# EAGLE schematic (Eagle)PowerUnit-Bseries(ver2.0) (EAGLE 9.6.2)

## Sheet 1 of 3
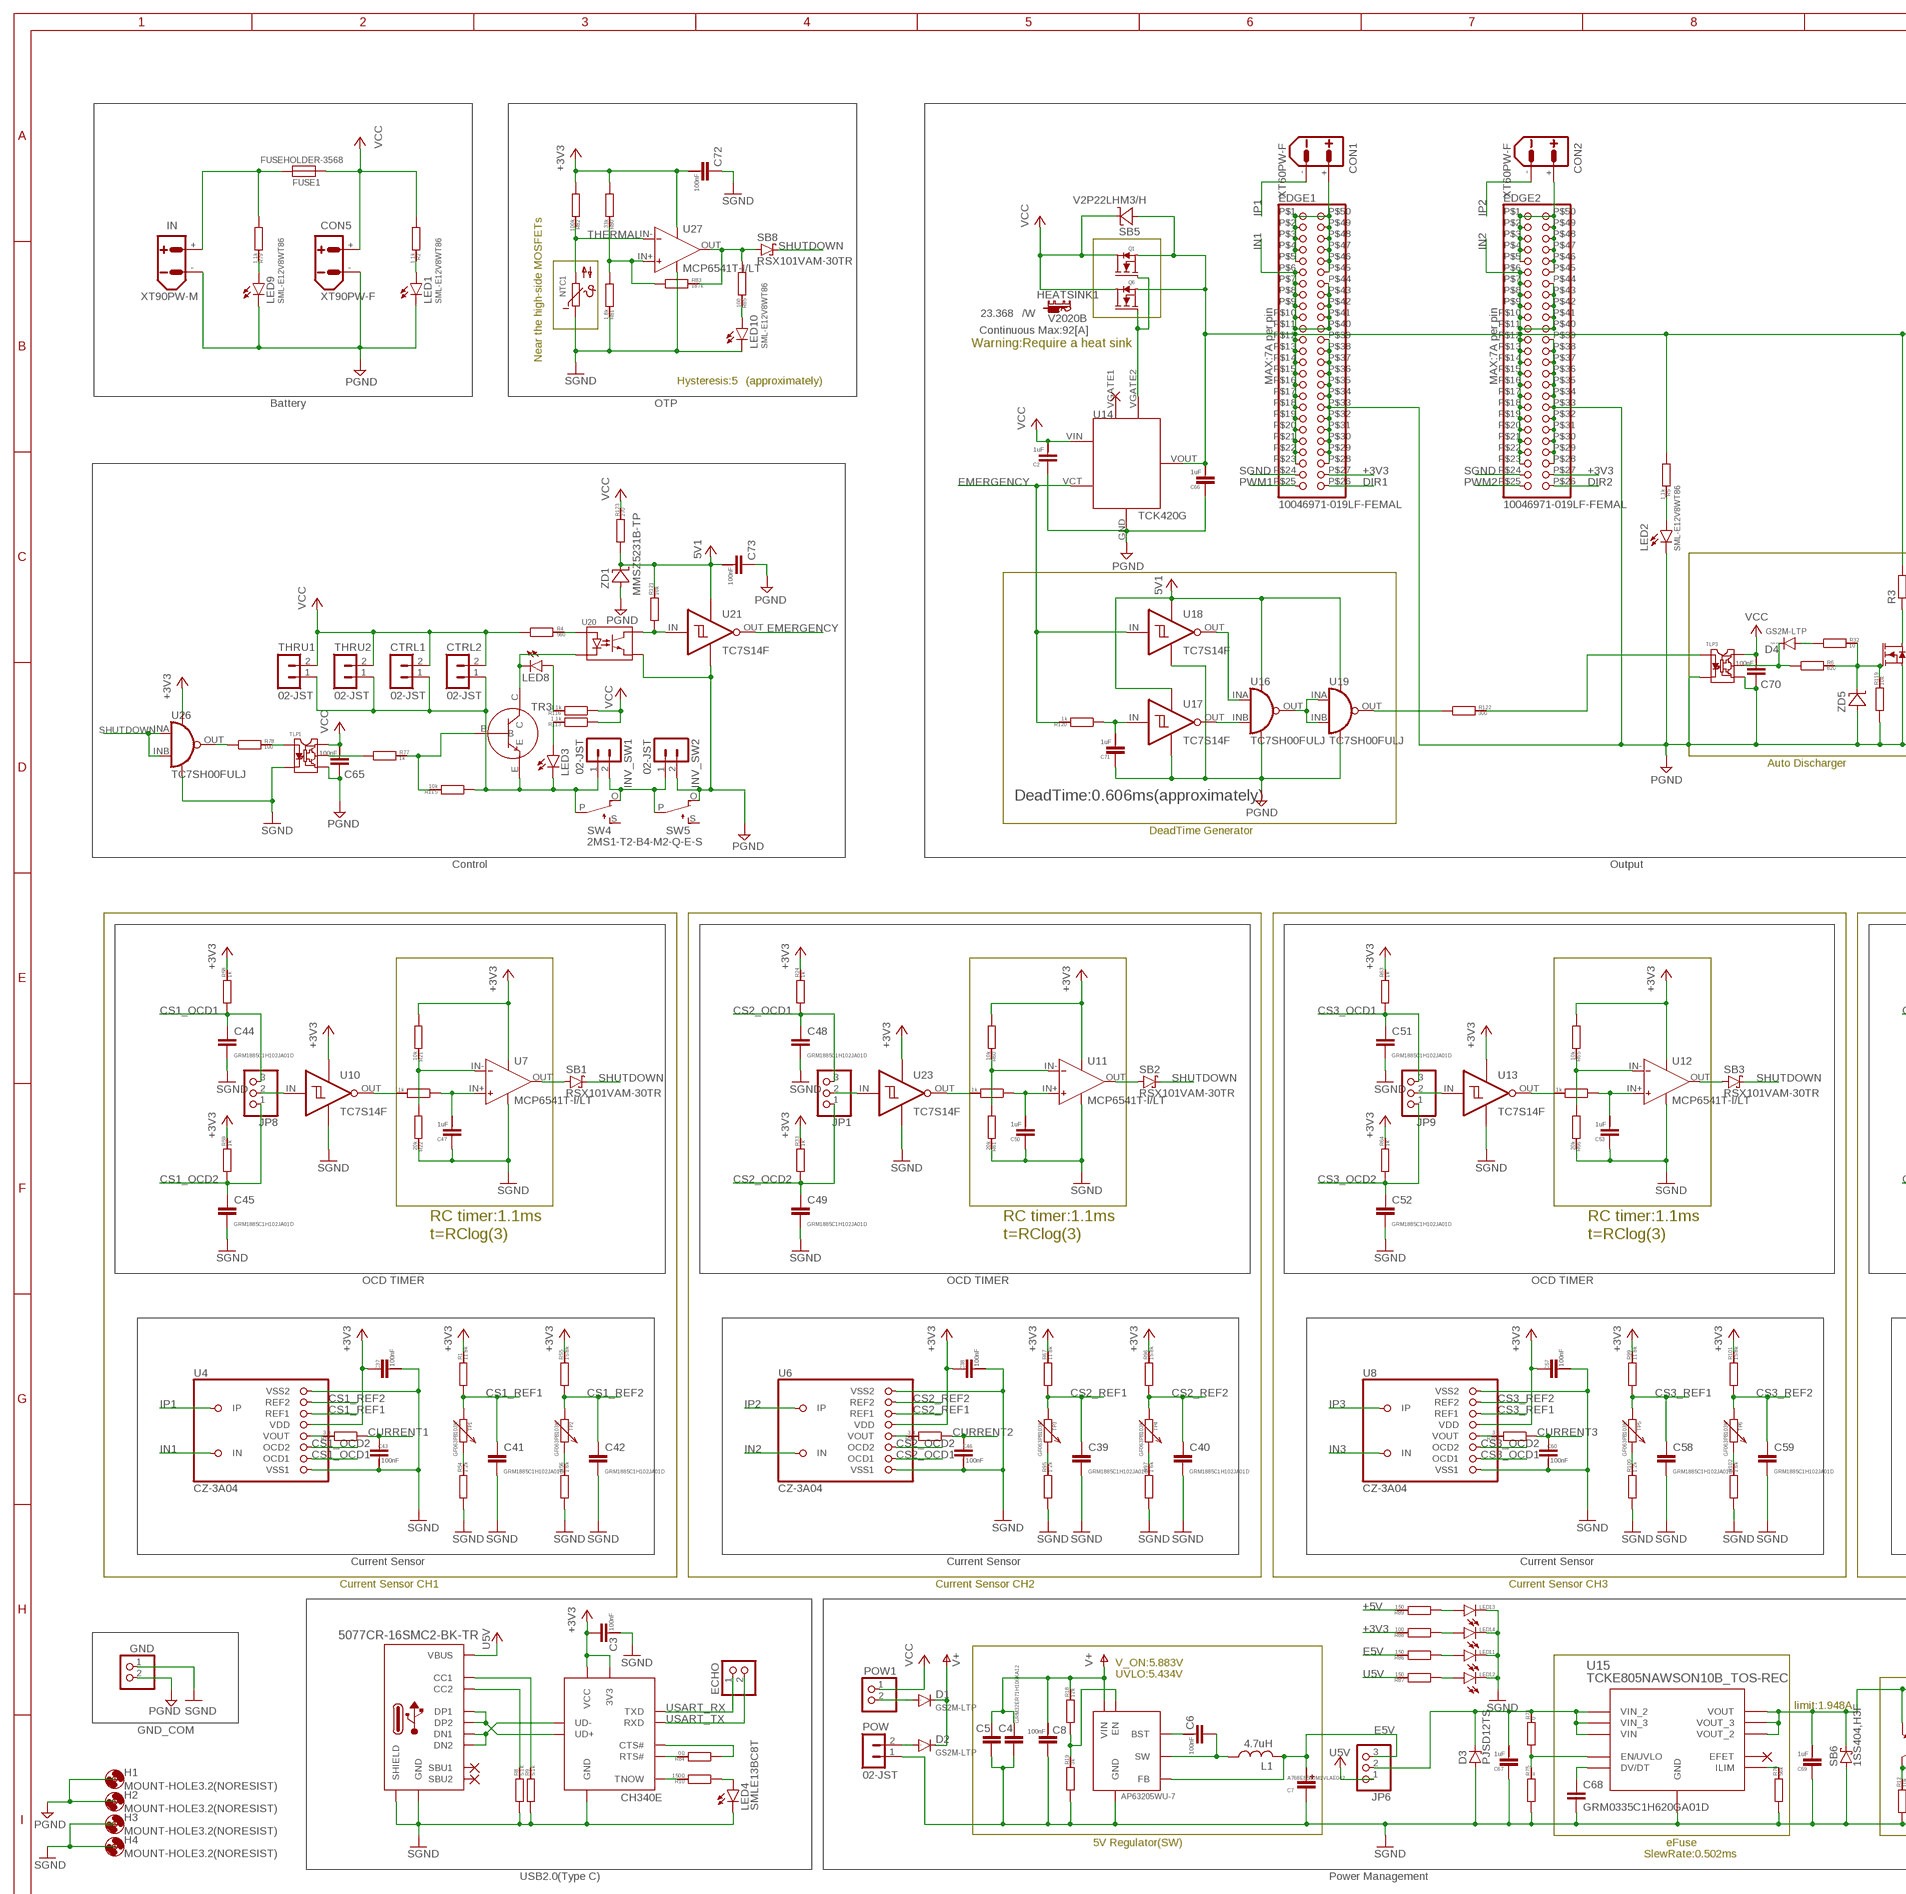
[diagram p0: schematic, sheet 1, part 1 of 2]
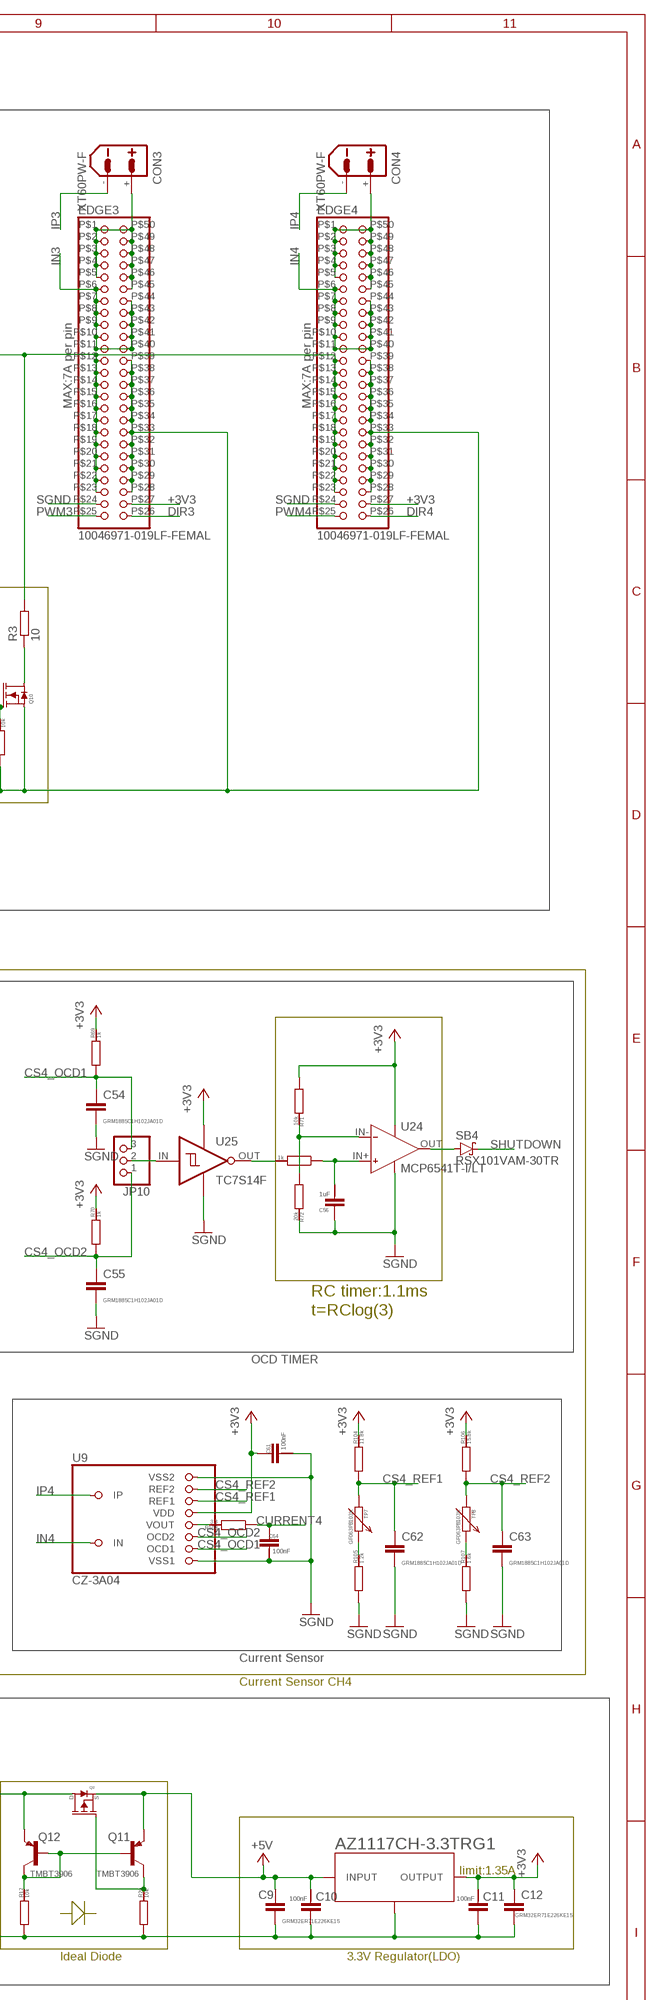
[diagram p1: schematic, sheet 1, part 2 of 2]

### Parts
C2  GRM21BC72A105KE01  [GRM21BC72A105KE01]
C3  GCM188L81H104KA57  [GCM188L81H104KA57]
C4  GRM32ER71H106KA12  [GRM32ER71H106KA12]
C5  GRM32ER71H106KA12  [GRM32ER71H106KA12]
C6  GCM188L81H104KA57  [GCM188L81H104KA57]
C7  A768EB566M1VLAE042  [A768EB566M1VLAE042]
C8  GCM188L81H104KA57  [GCM188L81H104KA57]
C9  GRM32ER71E226KE15  [3225M]
C10  GCM188L81H104KA57  [GCM188L81H104KA57]
C11  GCM188L81H104KA57  [GCM188L81H104KA57]
C12  GRM32ER71E226KE15  [3225M]
C37  GCM188L81H104KA57  [GCM188L81H104KA57]
C38  GCM188L81H104KA57  [GCM188L81H104KA57]
C39  GRM1885C1H102JA01D  [GRM18]
C40  GRM1885C1H102JA01D  [GRM18]
C41  GRM1885C1H102JA01D  [GRM18]
C42  GRM1885C1H102JA01D  [GRM18]
C43  GCM188L81H104KA57  [GCM188L81H104KA57]
C44  GRM1885C1H102JA01D  [GRM18]
C45  GRM1885C1H102JA01D  [GRM18]
C46  GCM188L81H104KA57  [GCM188L81H104KA57]
C47  GRM21BC72A105KE01  [GRM21BC72A105KE01]
C48  GRM1885C1H102JA01D  [GRM18]
C49  GRM1885C1H102JA01D  [GRM18]
C50  GRM21BC72A105KE01  [GRM21BC72A105KE01]
C51  GRM1885C1H102JA01D  [GRM18]
C52  GRM1885C1H102JA01D  [GRM18]
C53  GRM21BC72A105KE01  [GRM21BC72A105KE01]
C54  GRM1885C1H102JA01D  [GRM18]
C55  GRM1885C1H102JA01D  [GRM18]
C56  GRM21BC72A105KE01  [GRM21BC72A105KE01]
C57  GCM188L81H104KA57  [GCM188L81H104KA57]
C58  GRM1885C1H102JA01D  [GRM18]
C59  GRM1885C1H102JA01D  [GRM18]
C60  GCM188L81H104KA57  [GCM188L81H104KA57]
C61  GCM188L81H104KA57  [GCM188L81H104KA57]
C62  GRM1885C1H102JA01D  [GRM18]
C63  GRM1885C1H102JA01D  [GRM18]
C64  GCM188L81H104KA57  [GCM188L81H104KA57]
C65  GCM188L81H104KA57  [GCM188L81H104KA57]
C66  GRM21BC72A105KE01  [GRM21BC72A105KE01]
C67  GRM21BC72A105KE01  [GRM21BC72A105KE01]
C68  GRM0335C1H620GA01D  [GRM0335C1E240GA01D]
C69  GRM21BC72A105KE01  [GRM21BC72A105KE01]
C70  GCM188L81H104KA57  [GCM188L81H104KA57]
C71  GRM21BC72A105KE01  [GRM21BC72A105KE01]
C72  GCM188L81H104KA57  [GCM188L81H104KA57]
C73  GCM188L81H104KA57  [GCM188L81H104KA57]
CON1  XT60PW-F  [XT60PW-F]
CON2  XT60PW-F  [XT60PW-F]
CON3  XT60PW-F  [XT60PW-F]
CON4  XT60PW-F  [XT60PW-F]
CON5  XT90PW-F  [XT90PW-F]
CTRL1  02-JST  [B2B-XH]
CTRL2  02-JST  [B2B-XH]
D1  GS2M-LTP  [GS2M-LTP]
D2  GS2M-LTP  [GS2M-LTP]
D3  PJSD12TS  [SOD-523]
D4  GS2M-LTP  [GS2M-LTP]
ECHO  PINHD-1X2  [1X02]
EDGE1  10046971-019LF-FEMAL  [10046971-019LF]
EDGE2  10046971-019LF-FEMAL  [10046971-019LF]
EDGE3  10046971-019LF-FEMAL  [10046971-019LF]
EDGE4  10046971-019LF-FEMAL  [10046971-019LF]
FUSE1  FUSEHOLDER-3568  [FUSEHOLDER-3568]
GND  PINHD-1X2  [1X02]
H1  MOUNT-HOLE3.2(NORESIST)  [3,2]
H2  MOUNT-HOLE3.2(NORESIST)  [3,2]
H3  MOUNT-HOLE3.2(NORESIST)  [3,2]
H4  MOUNT-HOLE3.2(NORESIST)  [3,2]
HEATSINK1  V2020B  [V2020B]
IN  XT90PW-M  [XT90PW-M]
INV_SW1  02-JST  [B2B-XH]
INV_SW2  02-JST  [B2B-XH]
JP1  PINHD-1X3  [1X03]
JP6  PINHD-1X3  [1X03]
JP8  PINHD-1X3  [1X03]
JP9  PINHD-1X3  [1X03]
JP10  PINHD-1X3  [1X03]
L1  4.7uH  NRS5030T4R7MMGJ  [NRS5030T4R7MMGJ]
LED1  SML-E12V8WT86  [SML-E12V8WT86]
LED2  SML-E12V8WT86  [SML-E12V8WT86]
LED3  SML-E12V8WT86  [SML-E12V8WT86]
LED4  SMLE13BC8T  SML-E12V8WT86  [SML-E12V8WT86]
LED8  SML-E12V8WT86  [SML-E12V8WT86]
LED9  SML-E12V8WT86  [SML-E12V8WT86]
LED10  SML-E12V8WT86  [SML-E12V8WT86]
LED11  SML-E12V8WT86  [SML-E12V8WT86]
LED12  SML-E12V8WT86  [SML-E12V8WT86]
LED13  SML-E12V8WT86  [SML-E12V8WT86]
LED14  SML-E12V8WT86  [SML-E12V8WT86]
NTC1  NCU15WB473F60RC  [NCU15WB473F60RC]
POW  02-JST  [B2B-XH]
POW1  PINHD-1X2  [1X02]
Q1  SQJA16EP-T1_GE3  [SQJA16EP-T1_GE3]
Q2  SSM3J332R  [SOT-23F]
Q6  SQJA16EP-T1_GE3  [SQJA16EP-T1_GE3]
Q10  SQJA16EP-T1_GE3  [SQJA16EP-T1_GE3]
Q11  TMBT3906  [TMBT3906]
Q12  TMBT3906  [TMBT3906]
R1  11.8k  CR0603  [CR0603]
R2  1.1k  CR0603  [CR0603]
R3  10  RSMF2JT10R0  [0411V]
R4  560  CR0603  [CR0603]
R5  1.1k  CR0603  [CR0603]
R6  820  CR0603  [CR0603]
R8  5.1k  CR0603  [CR0603]
R9  5.1k  CR0603  [CR0603]
R10  150Ω  CR0603  [CR0603]
R12  10k  CR0603  [CR0603]
R18  12k  CR0603  [CR0603]
R19  3k  CR0603  [CR0603]
R20  10k  CR0603  [CR0603]
R21  10k  CR0603  [CR0603]
R22  20k  CR0603  [CR0603]
R23  1k  CR0603  [CR0603]
R24  1k  CR0603  [CR0603]
R32  10  CR0603  [CR0603]
R33  1k  CR0603  [CR0603]
R54  1.2k  CR0603  [CR0603]
R55  15.8k  CR0603  [CR0603]
R56  1.6k  CR0603  [CR0603]
R57  3.3  CR0603  [CR0603]
R58  1k  CR0603  [CR0603]
R59  1k  CR0603  [CR0603]
R60  10k  CR0603  [CR0603]
R61  20k  CR0603  [CR0603]
R62  1k  CR0603  [CR0603]
R63  1k  CR0603  [CR0603]
R64  1k  CR0603  [CR0603]
R65  10k  CR0603  [CR0603]
R66  20k  CR0603  [CR0603]
R67  11.8k  CR0603  [CR0603]
R68  1k  CR0603  [CR0603]
R69  1k  CR0603  [CR0603]
R70  1k  CR0603  [CR0603]
R71  10k  CR0603  [CR0603]
R72  20k  CR0603  [CR0603]
R73  1k  CR0603  [CR0603]
R74  0  CR0603  [CR0603]
R75  ∞  CR0603  [CR0603]
R76  56k  CR0603  [CR0603]
R77  1k  CR0603  [CR0603]
R78  100  CR0603  [CR0603]
R79  1.1k  CR0603  [CR0603]
R80  33k  CR0603  [CR0603]
R81  1.8k  CR0603  [CR0603]
R82  100k  CR0603  [CR0603]
R83  187k  CR0603  [CR0603]
R84  0Ω  CR0603  [CR0603]
R85  100  CR0603  [CR0603]
R86  150  CR0603  [CR0603]
R87  150  CR0603  [CR0603]
R88  100  CR0603  [CR0603]
R89  150  CR0603  [CR0603]
R95  1.2k  CR0603  [CR0603]
R96  15.8k  CR0603  [CR0603]
R97  1.6k  CR0603  [CR0603]
R98  3.3  CR0603  [CR0603]
R99  11.8k  CR0603  [CR0603]
R100  1.2k  CR0603  [CR0603]
R101  15.8k  CR0603  [CR0603]
R102  1.6k  CR0603  [CR0603]
R103  3.3  CR0603  [CR0603]
R104  11.8k  CR0603  [CR0603]
R105  1.2k  CR0603  [CR0603]
R106  15.8k  CR0603  [CR0603]
R107  1.6k  CR0603  [CR0603]
R108  3.3  CR0603  [CR0603]
R113  1.1k  CR0603  [CR0603]
R115  10k  CR0603  [CR0603]
R116  1.1k  CR0603  [CR0603]
R119  10k  CR0603  [CR0603]
R120  1k  CR0603  [CR0603]
R121  10k  CR0603  [CR0603]
R122  300  CR0603  [CR0603]
R123  270  CR0603  [CR0603]
SB1  RSX101VAM-30TR  [RSX101VAM-30TR]
SB2  RSX101VAM-30TR  [RSX101VAM-30TR]
SB3  RSX101VAM-30TR  [RSX101VAM-30TR]
SB4  RSX101VAM-30TR  [RSX101VAM-30TR]
SB5  V2P22LHM3/H  [V2P22LHM3/H]
SB6  1SS404,H3F  [1SS404,H3F]
SB8  RSX101VAM-30TR  [RSX101VAM-30TR]
SW4  2MS1-T2-B4-M2-Q-E-S  [2MS1-T2-B4-M2-Q-E-S]
SW5  2MS1-T2-B4-M2-Q-E-S  [2MS1-T2-B4-M2-Q-E-S]
THRU1  02-JST  [B2B-XH]
THRU2  02-JST  [B2B-XH]
TLP1  TLP152  [TLP152]
TLP3  TLP152  [TLP152]
TP1  GF063PB103K  [GF063PB104K]
TP2  GF063PB103K  [GF063PB104K]
TP3  GF063PB103K  [GF063PB104K]
TP4  GF063PB103K  [GF063PB104K]
TP5  GF063PB103K  [GF063PB104K]
TP6  GF063PB103K  [GF063PB104K]
TP7  GF063PB103K  [GF063PB104K]
TP8  GF063PB103K  [GF063PB104K]
TR3  2SC3325  [2SC3325]
U3  CH340E  [MSOP-10]
U4  CZ-3A04  [CZ3A07]
U5  AP63205WU-7  [AP63203WU-7]
U6  CZ-3A04  [CZ3A07]
U7  MCP6541T-I/LT  [SC-70-5]
U8  CZ-3A04  [CZ3A07]
U9  CZ-3A04  [CZ3A07]
U10  TC7S14F  [TC7S14F]
U11  MCP6541T-I/LT  [SC-70-5]
U12  MCP6541T-I/LT  [SC-70-5]
U13  TC7S14F  [TC7S14F]
U14  TCK420G  [TCK420G]
U15  TCKE805NAWSON10B_TOS-REC  [WSON10B_TOS-RIC]
U16  TC7SH00FULJ  [SSOP5-P-0.65A]
U17  TC7S14F  [TC7S14F]
U18  TC7S14F  [TC7S14F]
U19  TC7SH00FULJ  [SSOP5-P-0.65A]
U20  TLP293  [TLP293]
U21  TC7S14F  [TC7S14F]
U23  TC7S14F  [TC7S14F]
U24  MCP6541T-I/LT  [SC-70-5]
U25  TC7S14F  [TC7S14F]
U26  TC7SH00FULJ  [SSOP5-P-0.65A]
U27  MCP6541T-I/LT  [SC-70-5]
U$4  AZ1117CH-3.3TRG1  [AZ1117C]
USB1  5077CR-16SMC2-BK-TR  [5077CR-16SMC2-BK-TR]
ZD1  MMSZ5231B-TP  [MMSZ5231B-TP]
ZD5  MMBZ5248B-TP  [MMBZ5248B-TP]

### Nets
5V1: C73.P$1 R121.RIGHT R123.LEFT U16.VCC U17.VCC U18.VCC U19.VCC U21.VCC ZD1.CATHODE(C) ; supply symbol labelled VCC
+3V3: C3.P$2 C11.P$1 C12.L C37.P$2 C38.P$2 C57.P$2 C61.P$2 C72.P$1 EDGE1.P$27(P27) EDGE2.P$27(P27) EDGE3.P$27(P27) EDGE4.P$27(P27) R1.RIGHT R21.LEFT R24.RIGHT R33.RIGHT R55.RIGHT R58.RIGHT R59.RIGHT R60.LEFT R63.RIGHT R64.RIGHT R65.LEFT R67.RIGHT R69.RIGHT R70.RIGHT R71.LEFT R80.LEFT R82.LEFT R88.RIGHT R96.RIGHT R99.RIGHT R101.RIGHT R104.RIGHT R106.RIGHT U3.3V3 U3.VCC U4.VDD U6.VDD U7.VDD U8.VDD U9.VDD U10.VCC U11.VDD U12.VDD U13.VCC U23.VCC U24.VDD U25.VCC U26.VCC U27.VDD U$4.OUTPUT U$4.VOUT(OUTPUT) ; also sheet 2,3
+5V: C9.L C10.P$1 Q2.S(SOURCE) Q11.E R89.RIGHT U$4.INPUT ; also sheet 2,3
CS1_OCD1: C44.L JP8.3 R58.LEFT U4.OCD1
CS1_OCD2: C45.L JP8.1 R59.LEFT U4.OCD2
CS1_REF1: C41.L R1.LEFT TP1.CENTER(LEFT) TP1.LEFT U4.REF1
CS1_REF2: C42.L R55.LEFT TP2.CENTER(LEFT) TP2.LEFT U4.REF2
CS2_OCD1: C48.L JP1.3 R24.LEFT U6.OCD1
CS2_OCD2: C49.L JP1.1 R33.LEFT U6.OCD2
CS2_REF1: C39.L R67.LEFT TP3.CENTER(LEFT) TP3.LEFT U6.REF1
CS2_REF2: C40.L R96.LEFT TP4.CENTER(LEFT) TP4.LEFT U6.REF2
CS3_OCD1: C51.L JP9.3 R63.LEFT U8.OCD1
CS3_OCD2: C52.L JP9.1 R64.LEFT U8.OCD2
CS3_REF1: C58.L R99.LEFT TP5.CENTER(LEFT) TP5.LEFT U8.REF1
CS3_REF2: C59.L R101.LEFT TP6.CENTER(LEFT) TP6.LEFT U8.REF2
CS4_OCD1: C54.L JP10.3 R69.LEFT U9.OCD1
CS4_OCD2: C55.L JP10.1 R70.LEFT U9.OCD2
CS4_REF1: C62.L R104.LEFT TP7.CENTER(LEFT) TP7.LEFT U9.REF1
CS4_REF2: C63.L R106.LEFT TP8.CENTER(LEFT) TP8.LEFT U9.REF2
CURRENT1: C43.P$2 R57.LEFT ; also sheet 2
CURRENT2: C46.P$2 R98.LEFT ; also sheet 2
CURRENT3: C60.P$2 R103.LEFT ; also sheet 2
CURRENT4: C64.P$2 R108.LEFT ; also sheet 2
DIR1: EDGE1.P$26(P26) ; also sheet 2
DIR2: EDGE2.P$26(P26) ; also sheet 2
DIR3: EDGE3.P$26(P26) ; also sheet 2
DIR4: EDGE4.P$26(P26) ; also sheet 2
E5V: C7.ANODE JP6.3 L1.R R86.RIGHT U5.FB
EMERGENCY: R120.RIGHT U14.VCT U18.IN(I) U21.OUT(O)
IN1: EDGE1.P$6(P6) EDGE1.P$7(P7) EDGE1.P$8(P8) EDGE1.P$9(P9) EDGE1.P$10(P10) EDGE1.P$11(P11) EDGE1.P$40(P40) EDGE1.P$41(P41) EDGE1.P$42(P42) EDGE1.P$43(P43) EDGE1.P$44(P44) U4.IN
IN2: EDGE2.P$6(P6) EDGE2.P$7(P7) EDGE2.P$8(P8) EDGE2.P$9(P9) EDGE2.P$10(P10) EDGE2.P$11(P11) EDGE2.P$40(P40) EDGE2.P$41(P41) EDGE2.P$42(P42) EDGE2.P$43(P43) EDGE2.P$44(P44) U6.IN
IN3: EDGE3.P$6(P6) EDGE3.P$7(P7) EDGE3.P$8(P8) EDGE3.P$9(P9) EDGE3.P$10(P10) EDGE3.P$11(P11) EDGE3.P$40(P40) EDGE3.P$41(P41) EDGE3.P$42(P42) EDGE3.P$43(P43) EDGE3.P$44(P44) U8.IN
IN4: EDGE4.P$6(P6) EDGE4.P$7(P7) EDGE4.P$8(P8) EDGE4.P$9(P9) EDGE4.P$10(P10) EDGE4.P$11(P11) EDGE4.P$40(P40) EDGE4.P$41(P41) EDGE4.P$42(P42) EDGE4.P$43(P43) EDGE4.P$44(P44) U9.IN
IP1: CON1.- U4.IP
IP2: CON2.- U6.IP
IP3: CON3.- U8.IP
IP4: CON4.- U9.IP
N$1: R57.RIGHT U4.VOUT
N$2: R56.RIGHT TP2.RIGHT
N$3: LED2.A R5.RIGHT
N$4: CON1.+ EDGE1.P$1(P1) EDGE1.P$2(P2) EDGE1.P$3(P3) EDGE1.P$4(P4) EDGE1.P$5(P5) EDGE1.P$45(P45) EDGE1.P$46(P46) EDGE1.P$47(P47) EDGE1.P$48(P48) EDGE1.P$49(P49) EDGE1.P$50(P50)
N$5: CON2.+ EDGE2.P$1(P1) EDGE2.P$2(P2) EDGE2.P$3(P3) EDGE2.P$4(P4) EDGE2.P$5(P5) EDGE2.P$45(P45) EDGE2.P$46(P46) EDGE2.P$47(P47) EDGE2.P$48(P48) EDGE2.P$49(P49) EDGE2.P$50(P50)
N$6: CON3.+ EDGE3.P$1(P1) EDGE3.P$2(P2) EDGE3.P$3(P3) EDGE3.P$4(P4) EDGE3.P$5(P5) EDGE3.P$45(P45) EDGE3.P$46(P46) EDGE3.P$47(P47) EDGE3.P$48(P48) EDGE3.P$49(P49) EDGE3.P$50(P50)
N$7: LED8.A R116.RIGHT
N$8: R74.LEFT R75.RIGHT U15.EN/UVLO
N$9: JP8.2 U10.IN(I)
N$10: CON4.+ EDGE4.P$1(P1) EDGE4.P$2(P2) EDGE4.P$3(P3) EDGE4.P$4(P4) EDGE4.P$5(P5) EDGE4.P$45(P45) EDGE4.P$46(P46) EDGE4.P$47(P47) EDGE4.P$48(P48) EDGE4.P$49(P49) EDGE4.P$50(P50)
N$11: Q10.D R3.1
N$12: R77.LEFT TLP1.VO(VOUT)
N$13: R54.RIGHT TP1.RIGHT
N$14: R77.RIGHT R115.RIGHT TR3.B
N$16: LED8.K(C) TR3.C U20.CATHODE
N$17: LED1.A R2.RIGHT
N$18: R60.RIGHT R61.LEFT U11.IN-
N$19: INV_SW1.2 INV_SW2.1 SW4.O SW5.P
N$20: C67.P$1 D3.C JP6.2 R74.RIGHT U15.VIN1(VIN) U15.VIN2(VIN_2) U15.VIN3(VIN_3)
N$21: CTRL1.1 CTRL2.1 INV_SW1.1 LED3.K(C) R115.LEFT SW4.P THRU1.1 THRU2.1 TR3.E
N$22: U16.INB(I1) U17.OUT(O)
N$24: LED3.A R113.RIGHT
N$25: FUSE1.R1(R) FUSE1.R2(R) IN.+ R79.LEFT
N$26: Q1.G Q6.G U14.VGATE2
N$29: R8.RIGHT USB1.CC2
N$30: R9.RIGHT USB1.CC1
N$31: U3.UD+ USB1.DP1 USB1.DP2
N$32: U3.UD- USB1.DN1 USB1.DN2
N$33: R10.RIGHT U3.TNOW
N$34: LED4.A R10.LEFT
N$35: D1.A POW1.2
N$36: R18.LEFT R19.RIGHT U5.EN
N$37: D2.A POW.2
N$40: C6.P$2 L1.L U5.SW
N$41: C6.P$1 U5.BST
N$43: R21.RIGHT R22.LEFT U7.IN-
N$47: Q11.B Q12.B Q12.C R12.RIGHT
N$55: LED12.A R87.LEFT
N$75: C69.P$1 Q2.D(DRAIN) Q12.E SB6.C U15.VOUT1(VOUT) U15.VOUT2(VOUT_2) U15.VOUT3(VOUT_3)
N$76: C50.P$1 R62.LEFT U11.IN+
N$77: SB2.A U11.OUT
N$78: C47.P$1 R23.LEFT U7.IN+
N$79: R95.RIGHT TP3.RIGHT
N$80: R97.RIGHT TP4.RIGHT
N$81: R98.RIGHT U6.VOUT
N$82: R100.RIGHT TP5.RIGHT
N$83: JP1.2 U23.IN(I)
N$84: R65.RIGHT R66.LEFT U12.IN-
N$85: C53.P$1 R68.LEFT U12.IN+
N$86: SB3.A U12.OUT
N$87: JP9.2 U13.IN(I)
N$88: R68.RIGHT U13.OUT(O)
N$89: R71.RIGHT R72.LEFT U24.IN-
N$90: C56.P$1 R73.LEFT U24.IN+
N$91: SB4.A U24.OUT
N$92: R78.LEFT U26.OUT(O)
N$93: C71.P$1 R120.LEFT U17.IN(I)
N$94: R4.RIGHT U20.ANODE
N$95: D4.C R6.LEFT TLP3.VO(VOUT)
N$96: Q10.G R6.RIGHT R32.RIGHT R119.RIGHT ZD5.CATHODE(C)
N$97: SB1.A U7.OUT
N$98: R102.RIGHT TP6.RIGHT
N$99: R103.RIGHT U8.VOUT
N$100: R105.RIGHT TP7.RIGHT
N$101: R107.RIGHT TP8.RIGHT
N$102: R108.RIGHT U9.VOUT
N$103: Q2.G(GATE) Q11.C R20.RIGHT
N$105: R23.RIGHT U10.OUT(O)
N$106: R122.LEFT U19.OUT(O)
N$107: U16.INA(I0) U18.OUT(O)
N$108: U16.OUT(O) U19.INA(I0) U19.INB(I1)
N$109: R121.LEFT U20.COLLECTOR U21.IN(I)
N$110: R122.RIGHT TLP3.ANODE
N$111: C66.P$1 EDGE1.P$12(P12) EDGE1.P$13(P13) EDGE1.P$14(P14) EDGE1.P$15(P15) EDGE1.P$16(P16) EDGE1.P$17(P17) EDGE1.P$18(P18) EDGE1.P$19(P19) EDGE1.P$20(P20) EDGE1.P$21(P21) EDGE1.P$22(P22) EDGE1.P$23(P23) EDGE2.P$12(P12) EDGE2.P$13(P13) EDGE2.P$14(P14) EDGE2.P$15(P15) EDGE2.P$16(P16) EDGE2.P$17(P17) EDGE2.P$18(P18) EDGE2.P$19(P19) EDGE2.P$20(P20) EDGE2.P$21(P21) EDGE2.P$22(P22) EDGE2.P$23(P23) EDGE3.P$12(P12) EDGE3.P$13(P13) EDGE3.P$14(P14) EDGE3.P$15(P15) EDGE3.P$16(P16) EDGE3.P$17(P17) EDGE3.P$18(P18) EDGE3.P$19(P19) EDGE3.P$20(P20) EDGE3.P$21(P21) EDGE3.P$22(P22) EDGE3.P$23(P23) EDGE4.P$12(P12) EDGE4.P$13(P13) EDGE4.P$14(P14) EDGE4.P$15(P15) EDGE4.P$16(P16) EDGE4.P$17(P17) EDGE4.P$18(P18) EDGE4.P$19(P19) EDGE4.P$20(P20) EDGE4.P$21(P21) EDGE4.P$22(P22) EDGE4.P$23(P23) Q1.S1(S) Q1.S2(S) Q1.S3(S) Q6.S1(S) Q6.S2(S) Q6.S3(S) R3.2 R5.LEFT SB5.A U14.VOUT
N$112: D4.A R32.LEFT
N$113: R62.RIGHT U23.OUT(O)
N$114: JP10.2 U25.IN(I)
N$115: R73.RIGHT U25.OUT(O)
N$116: R76.RIGHT U15.ILIM
N$117: C68.1 U15.DVDT(DV/DT)
N$118: R78.RIGHT TLP1.ANODE
N$120: LED9.A R79.RIGHT
N$121: R84.RIGHT U3.RTS#
N$122: R80.RIGHT R81.LEFT R83.LEFT U27.IN+
N$123: R84.LEFT U3.CTS#
N$124: LED10.A R85.RIGHT
N$125: LED11.A R86.LEFT
N$126: R83.RIGHT R85.LEFT SB8.A U27.OUT
N$129: LED13.A R89.LEFT
N$130: LED14.A R88.LEFT
PGND: C2.P$2 C65.P$2 C66.P$2 C70.P$2 C71.P$2 C73.P$2 CON5.- EDGE1.P$28(P28) EDGE1.P$29(P29) EDGE1.P$30(P30) EDGE1.P$31(P31) EDGE1.P$32(P32) EDGE1.P$33(P33) EDGE1.P$34(P34) EDGE1.P$35(P35) EDGE1.P$36(P36) EDGE1.P$37(P37) EDGE1.P$38(P38) EDGE1.P$39(P39) EDGE2.P$28(P28) EDGE2.P$29(P29) EDGE2.P$30(P30) EDGE2.P$31(P31) EDGE2.P$32(P32) EDGE2.P$33(P33) EDGE2.P$34(P34) EDGE2.P$35(P35) EDGE2.P$36(P36) EDGE2.P$37(P37) EDGE2.P$38(P38) EDGE2.P$39(P39) EDGE3.P$28(P28) EDGE3.P$29(P29) EDGE3.P$30(P30) EDGE3.P$31(P31) EDGE3.P$32(P32) EDGE3.P$33(P33) EDGE3.P$34(P34) EDGE3.P$35(P35) EDGE3.P$36(P36) EDGE3.P$37(P37) EDGE3.P$38(P38) EDGE3.P$39(P39) EDGE4.P$28(P28) EDGE4.P$29(P29) EDGE4.P$30(P30) EDGE4.P$31(P31) EDGE4.P$32(P32) EDGE4.P$33(P33) EDGE4.P$34(P34) EDGE4.P$35(P35) EDGE4.P$36(P36) EDGE4.P$37(P37) EDGE4.P$38(P38) EDGE4.P$39(P39) GND.2 H1.P$1 H2.P$1 IN.- INV_SW2.2 LED1.K(C) LED2.K(C) LED9.K(C) Q10.S1(S) Q10.S2(S) Q10.S3(S) R119.LEFT SW5.O TLP1.GND TLP3.CATHODE TLP3.GND U14.GND U16.GND U17.GND U18.GND U19.GND U20.EMITTER U21.GND ZD1.ANODE(A) ZD5.ANODE(A) ; supply symbol labelled GND
PWM1: EDGE1.P$25(P25) ; also sheet 2
PWM2: EDGE2.P$25(P25) ; also sheet 2
PWM3: EDGE3.P$25(P25) ; also sheet 2
PWM4: EDGE4.P$25(P25) ; also sheet 2
SGND: C3.P$1 C4.R C5.R C7.CATHODE C8.P$2 C9.R C10.P$2 C11.P$2 C12.R C37.P$1 C38.P$1 C39.R C40.R C41.R C42.R C43.P$1 C44.R C45.R C46.P$1 C47.P$2 C48.R C49.R C50.P$2 C51.R C52.R C53.P$2 C54.R C55.R C56.P$2 C57.P$1 C58.R C59.R C60.P$1 C61.P$1 C62.R C63.R C64.P$1 C67.P$2 C68.2 C69.P$2 C72.P$2 D3.A EDGE1.P$24(P24) EDGE2.P$24(P24) EDGE3.P$24(P24) EDGE4.P$24(P24) GND.1 H3.P$1 H4.P$1 LED4.K(C) LED10.K(C) LED11.K(C) LED12.K(C) LED13.K(C) LED14.K(C) NTC1.L POW.1 R8.LEFT R9.LEFT R12.LEFT R19.LEFT R20.LEFT R22.RIGHT R54.LEFT R56.LEFT R61.RIGHT R66.RIGHT R72.RIGHT R75.LEFT R76.LEFT R81.RIGHT R95.LEFT R97.LEFT R100.LEFT R102.LEFT R105.LEFT R107.LEFT SB6.A TLP1.CATHODE U3.GND U4.VSS1 U4.VSS2 U5.GND U6.VSS1 U6.VSS2 U7.VSS U8.VSS1 U8.VSS2 U9.VSS1 U9.VSS2 U10.GND U11.VSS U12.VSS U13.GND U15.GND1(GND) U15.GND2(GND) U15.GND3(GND) U15.GND4(GND) U15.GND5(GND) U23.GND U24.VSS U25.GND U26.GND U27.VSS U$4.GND USB1.GND1(GND) USB1.GND2(GND) USB1.SHIELD1(SHIELD) USB1.SHIELD2(SHIELD) USB1.SHIELD3(SHIELD) USB1.SHIELD4(SHIELD) ; supply symbol labelled GND ; also sheet 2,3
SHUTDOWN: SB1.C SB2.C SB3.C SB4.C SB8.C U26.INA(I0) U26.INB(I1) ; also sheet 2
THERMAL: NTC1.R R82.RIGHT U27.IN- ; also sheet 2
U5V: JP6.1 R87.RIGHT USB1.VBUS1(VBUS) USB1.VBUS2(VBUS) ; supply symbol labelled +5V
USART_RX: ECHO.1 U3.TXD ; also sheet 2
USART_TX: ECHO.2 U3.RXD ; also sheet 2
V+: C4.L C5.L C8.P$1 D1.C D2.C R18.RIGHT U5.VIN
VCC: C2.P$1 C65.P$1 C70.P$1 CON5.+ CTRL1.2 CTRL2.2 FUSE1.L1(L) FUSE1.L2(L) POW1.1 Q1.D Q6.D R2.LEFT R4.LEFT R113.LEFT R116.LEFT R123.RIGHT SB5.C THRU1.2 THRU2.2 TLP1.VCC TLP3.VCC U14.VIN
Unconnected: SW4.S SW5.S U14.VGATE1 U15.EFET USB1.SBU1 USB1.SBU2

### Notes on the sheet
- 23.368℃/W
- Continuous Max:92[A]
- Warning:Require a heat sink
- Near the high-side MOSFETs
- Hysteresis:5℃(approximately)
- Battery | OTP
- Auto Discharger
- DeadTime:0.606ms(approximately)
- DeadTime Generator
- Control | Output
- RC timer:1.1ms | RC timer:1.1ms | RC timer:1.1ms | RC timer:1.1ms
- t=RClog(3) | t=RClog(3) | t=RClog(3) | t=RClog(3)
- OCD TIMER | OCD TIMER | OCD TIMER | OCD TIMER
- Current Sensor | Current Sensor | Current Sensor | Current Sensor
- Current Sensor CH1 | Current Sensor CH2 | Current Sensor CH3 | Current Sensor CH4
- V_ON:5.883V
- UVLO:5.434V
- limit:1.948A
- GND_COM
- limit:1.35A
- 5V Regulator(SW) | eFuse | Ideal Diode | 3.3V Regulator(LDO)
- SlewRate:0.502ms
- USB2.0(Type C) | Power Management

## Sheet 2 of 3
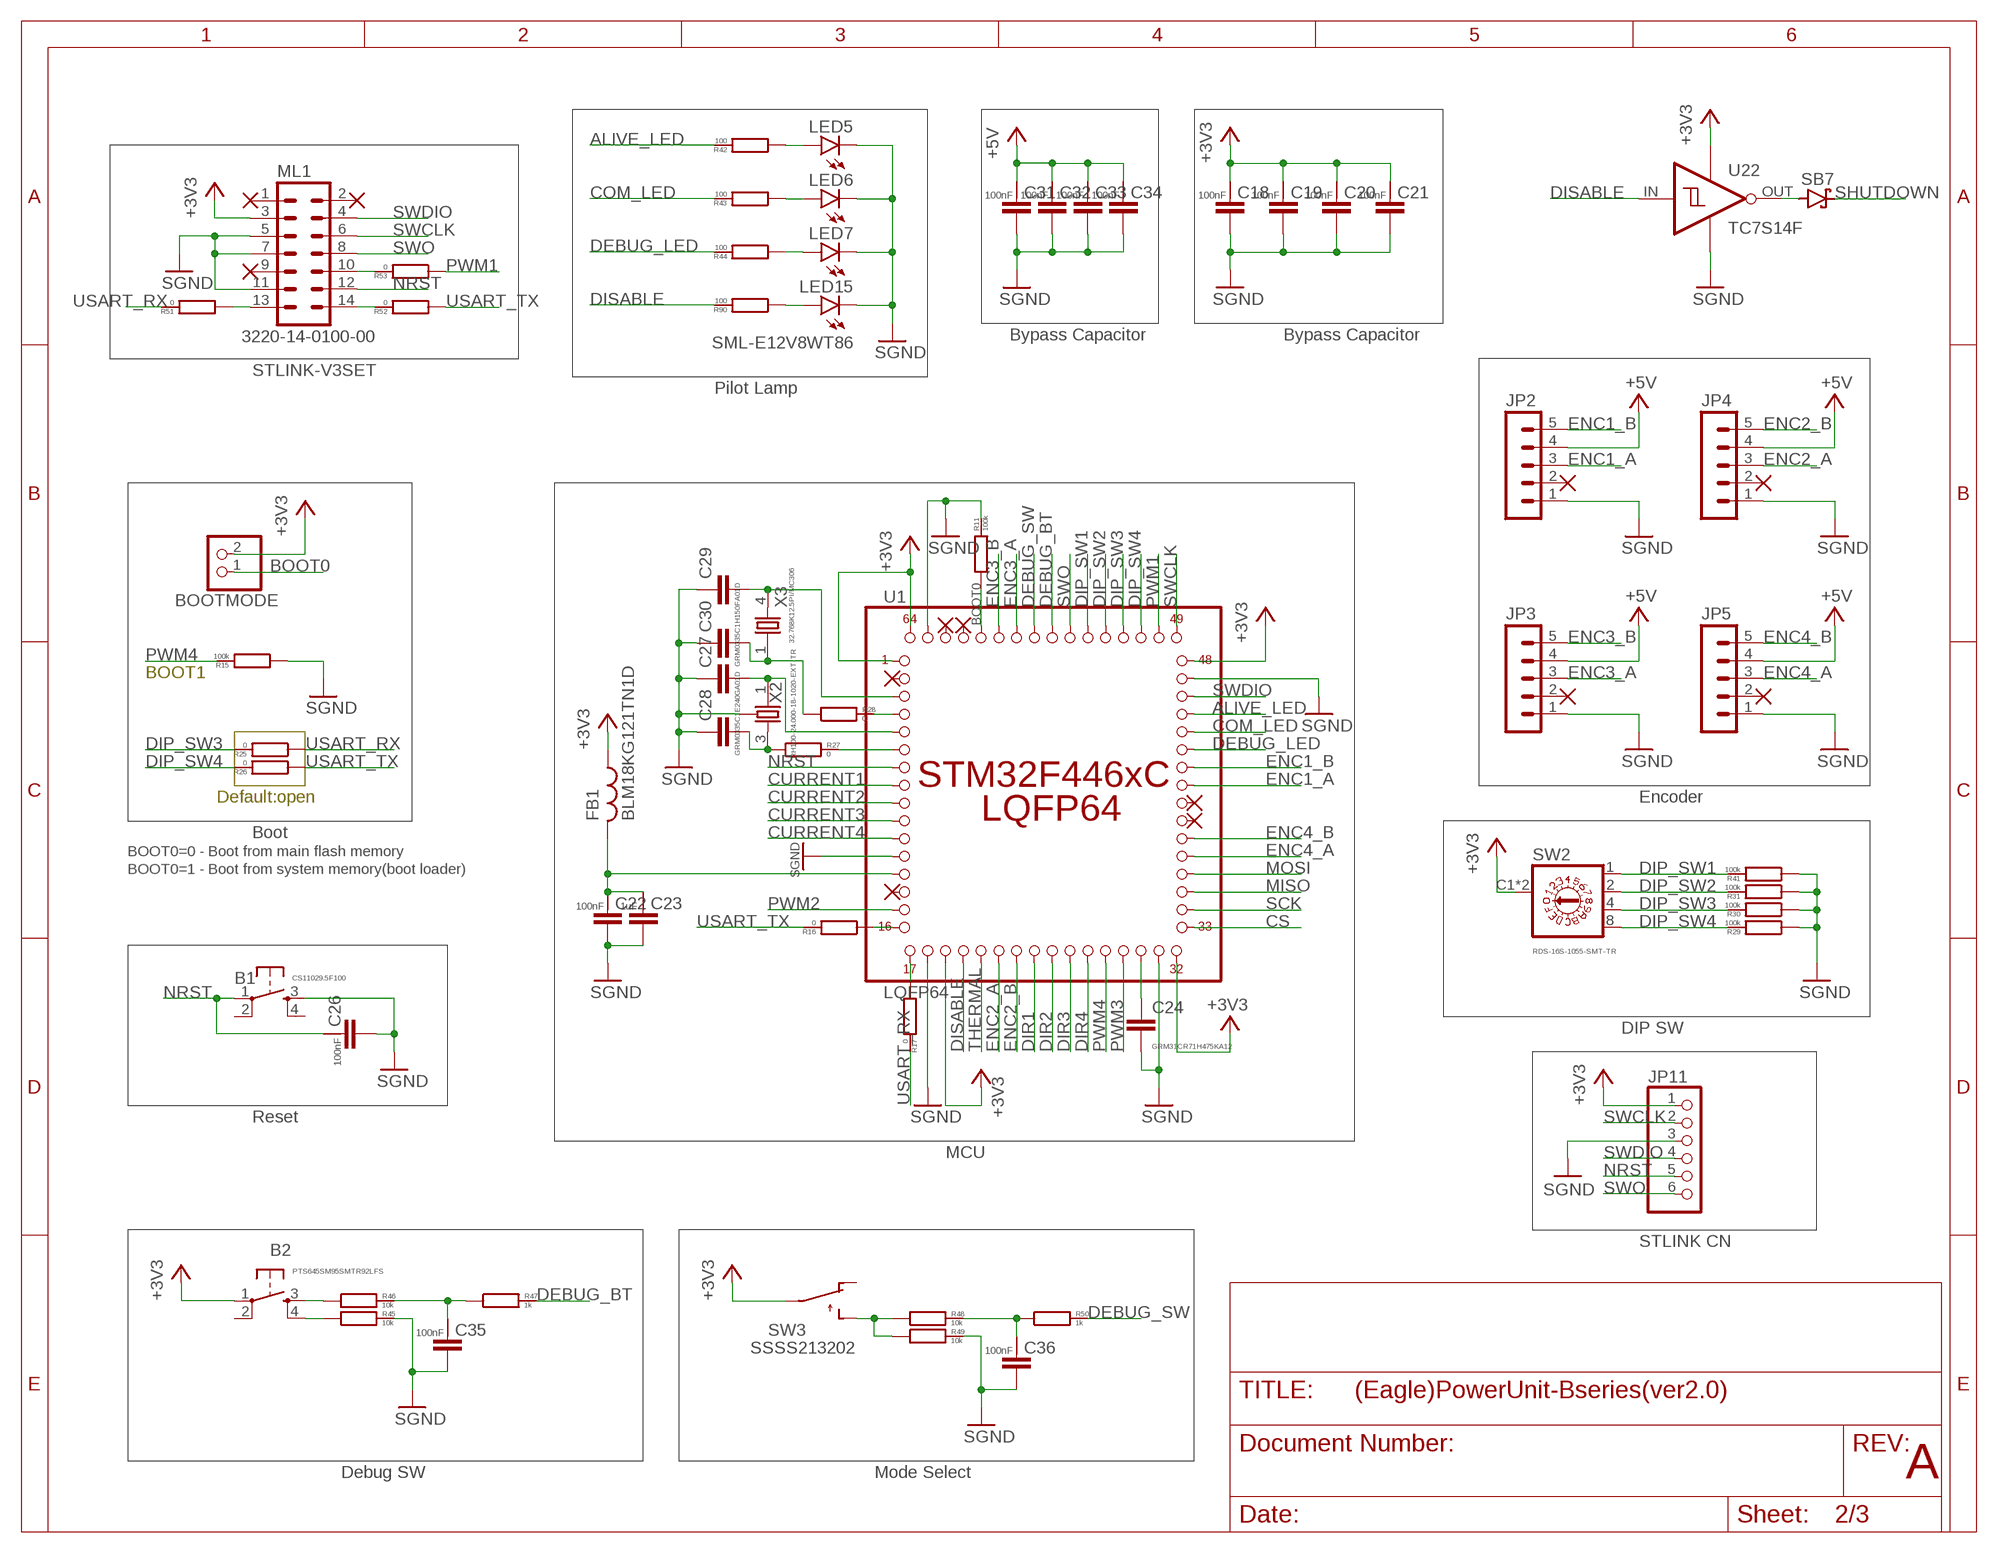
[diagram p2: schematic, sheet 2]

### Parts
B1  CS11029.5F100  [CS11029.5F100]
B2  PTS645SM95SMTR92LFS  [PTS645SM95SMTR92LFS]
BOOTMODE  PINHD-1X2  [1X02]
C18  GCM188L81H104KA57  [GCM188L81H104KA57]
C19  GCM188L81H104KA57  [GCM188L81H104KA57]
C20  GCM188L81H104KA57  [GCM188L81H104KA57]
C21  GCM188L81H104KA57  [GCM188L81H104KA57]
C22  GCM188L81H104KA57  [GCM188L81H104KA57]
C23  GRM21BC72A105KE01  [GRM21BC72A105KE01]
C24  GRM31CR71H475KA12  [GRM31CR71H475KA12]
C26  GCM188L81H104KA57  [GCM188L81H104KA57]
C27  GRM0335C1E240GA01D  [GRM0335C1E240GA01D]
C28  GRM0335C1E240GA01D  [GRM0335C1E240GA01D]
C29  GRM0335C1H150FA01D  [GRM0335C1H120GA01]
C30  GRM0335C1H150FA01D  [GRM0335C1H120GA01]
C31  GCM188L81H104KA57  [GCM188L81H104KA57]
C32  GCM188L81H104KA57  [GCM188L81H104KA57]
C33  GCM188L81H104KA57  [GCM188L81H104KA57]
C34  GCM188L81H104KA57  [GCM188L81H104KA57]
C35  GCM188L81H104KA57  [GCM188L81H104KA57]
C36  GCM188L81H104KA57  [GCM188L81H104KA57]
FB1  BLM18KG121TN1D  [BLM18KG121TN1D]
JP2  05-JST  [B5B-XH]
JP3  05-JST  [B5B-XH]
JP4  05-JST  [B5B-XH]
JP5  05-JST  [B5B-XH]
JP11  PINHD-1X6  [1X06]
LED5  SML-E12V8WT86  [SML-E12V8WT86]
LED6  SML-E12V8WT86  [SML-E12V8WT86]
LED7  SML-E12V8WT86  [SML-E12V8WT86]
LED15  SML-E12V8WT86  [SML-E12V8WT86]
ML1  3220-14-0100-00  [3220-14-0100-00]
R11  100k  CR0603  [CR0603]
R15  100k  CR0603  [CR0603]
R16  0  CR0603  [CR0603]
R17  0  CR0603  [CR0603]
R25  0  CR0603  [CR0603]
R26  0  CR0603  [CR0603]
R27  0  CR0603  [CR0603]
R28  0  CR0603  [CR0603]
R29  100k  CR0603  [CR0603]
R30  100k  CR0603  [CR0603]
R31  100k  CR0603  [CR0603]
R41  100k  CR0603  [CR0603]
R42  100  CR0603  [CR0603]
R43  100  CR0603  [CR0603]
R44  100  CR0603  [CR0603]
R45  10k  CR0603  [CR0603]
R46  10k  CR0603  [CR0603]
R47  1k  CR0603  [CR0603]
R48  10k  CR0603  [CR0603]
R49  10k  CR0603  [CR0603]
R50  1k  CR0603  [CR0603]
R51  0  CR0603  [CR0603]
R52  0  CR0603  [CR0603]
R53  0  CR0603  [CR0603]
R90  100  CR0603  [CR0603]
SB7  RSX101VAM-30TR  [RSX101VAM-30TR]
SW2  RDS-16S-1055-SMT-TR  [RDS-16S-1055-SMT-TR]
SW3  SSSS213202  [SSSS213202]
U1  LQFP64  [STM32F446XC]
U22  TC7S14F  [TC7S14F]
X2  RH100-24.000-18-1020-EXT-TR  [RH100-24.000-18-1020-EXT-TR]
X3  32.768K12.5PI/MC306  [32.768K12.5PI/MC306]

### Nets
+3V3: B2.1 BOOTMODE.2 C18.P$1 C19.P$1 C20.P$1 C21.P$1 FB1.1 JP11.1 ML1.3 SW2.C1(C) SW2.C2(C) SW3.2A(C) SW3.2B(C) U1.P1 U1.P19 U1.P32 U1.P48 U1.P64 U22.VCC ; also sheet 1,3
+5V: C31.P$1 C32.P$1 C33.P$1 C34.P$1 JP2.4 JP3.4 JP4.4 JP5.4 ; also sheet 1,3
ALIVE_LED: R42.RIGHT U1.P45
BOOT0: BOOTMODE.1 R11.LEFT U1.P60
COM_LED: R43.RIGHT U1.P44 ; also sheet 3
CS: U1.P33 ; also sheet 3
CURRENT1: U1.P8 ; also sheet 1
CURRENT2: U1.P9 ; also sheet 1
CURRENT3: U1.P10 ; also sheet 1
CURRENT4: U1.P11 ; also sheet 1
DEBUG_BT: R47.RIGHT U1.P56
DEBUG_LED: R44.RIGHT U1.P43
DEBUG_SW: R50.RIGHT U1.P57
DIP_SW1: R41.RIGHT SW2.1 U1.P54
DIP_SW2: R31.RIGHT SW2.2 U1.P53
DIP_SW3: R25.RIGHT R30.RIGHT SW2.4 U1.P52
DIP_SW4: R26.RIGHT R29.RIGHT SW2.8 U1.P51
DIR1: U1.P24 ; also sheet 1
DIR2: U1.P25 ; also sheet 1
DIR3: U1.P26 ; also sheet 1
DIR4: U1.P27 ; also sheet 1
DISABLE: R90.RIGHT U1.P20 U22.IN(I)
ENC1_A: JP2.3 U1.P41
ENC1_B: JP2.5 U1.P42
ENC2_A: JP4.3 U1.P22
ENC2_B: JP4.5 U1.P23
ENC3_A: JP3.3 U1.P58
ENC3_B: JP3.5 U1.P59
ENC4_A: JP5.3 U1.P37
ENC4_B: JP5.5 U1.P38
MISO: U1.P35 ; also sheet 3
MOSI: U1.P36 ; also sheet 3
N$44: R16.LEFT U1.P16
N$45: R17.LEFT U1.P17
N$46: C22.P$1 C23.P$1 FB1.2 U1.P13
N$48: C24.1 U1.P30
N$49: C27.2 U1.P5 X2.1
N$50: R28.RIGHT U1.P4
N$52: R27.RIGHT U1.P6
N$54: C28.2 R27.LEFT X2.3
N$56: C30.2 R28.LEFT X3.1
N$57: C29.2 U1.P3 X3.4
N$58: LED5.A R42.LEFT
N$59: LED6.A R43.LEFT
N$60: LED7.A R44.LEFT
N$61: B2.4 R45.LEFT
N$62: B2.3 R46.LEFT
N$63: R48.LEFT R49.LEFT SW3.3A(R) SW3.3B(R)
N$64: ML1.13 R51.LEFT
N$65: C36.P$1 R48.RIGHT R50.LEFT
N$66: ML1.14 R52.RIGHT
N$67: ML1.10 R53.RIGHT
N$104: C35.P$1 R46.RIGHT R47.LEFT
N$119: SB7.A U22.OUT(O)
N$127: LED15.A R90.LEFT
NRST: B1.1 C26.P$1 JP11.5 ML1.12 U1.P7
PWM1: R53.LEFT U1.P50 ; also sheet 1
PWM2: U1.P15 ; also sheet 1
PWM3: U1.P29 ; also sheet 1
PWM4: R15.RIGHT U1.P28 ; also sheet 1
SCK: U1.P34 ; also sheet 3
SGND: B1.3 C18.P$2 C19.P$2 C20.P$2 C21.P$2 C22.P$2 C23.P$2 C24.2 C26.P$2 C27.1 C28.1 C29.1 C30.1 C31.P$2 C32.P$2 C33.P$2 C34.P$2 C35.P$2 C36.P$2 JP2.1 JP3.1 JP4.1 JP5.1 JP11.3 LED5.K(C) LED6.K(C) LED7.K(C) LED15.K(C) ML1.5 ML1.7 ML1.11 R11.RIGHT R15.LEFT R29.LEFT R30.LEFT R31.LEFT R41.LEFT R45.RIGHT R49.RIGHT U1.P12 U1.P18 U1.P31 U1.P47 U1.P63 U22.GND X2.2(SHIELD) X2.4(SHIELD) ; supply symbol labelled GND ; also sheet 1,3
SHUTDOWN: SB7.C ; also sheet 1
SWCLK: JP11.2 ML1.6 U1.P49
SWDIO: JP11.4 ML1.4 U1.P46
SWO: JP11.6 ML1.8 U1.P55
THERMAL: U1.P21 ; also sheet 1
USART_RX: R17.RIGHT R25.LEFT R51.RIGHT ; also sheet 1
USART_TX: R16.RIGHT R26.LEFT R52.LEFT ; also sheet 1
Unconnected: B1.2 B1.4 B2.2 JP2.2 JP3.2 JP4.2 JP5.2 ML1.1 ML1.2 ML1.9 SW3.1A(L) SW3.1B(L) U1.P2 U1.P14 U1.P39 U1.P40 U1.P61 U1.P62

### Notes on the sheet
- Bypass Capacitor | Bypass Capacitor
- STLINK-V3SET
- Pilot Lamp
- BOOT1
- Default:open | Encoder
- Boot
- BOOT0=0 - Boot from main flash memory
- BOOT0=1 - Boot from system memory(boot loader)
- DIP SW
- Reset
- MCU
- STLINK CN
- Debug SW | Mode Select | A

## Sheet 3 of 3
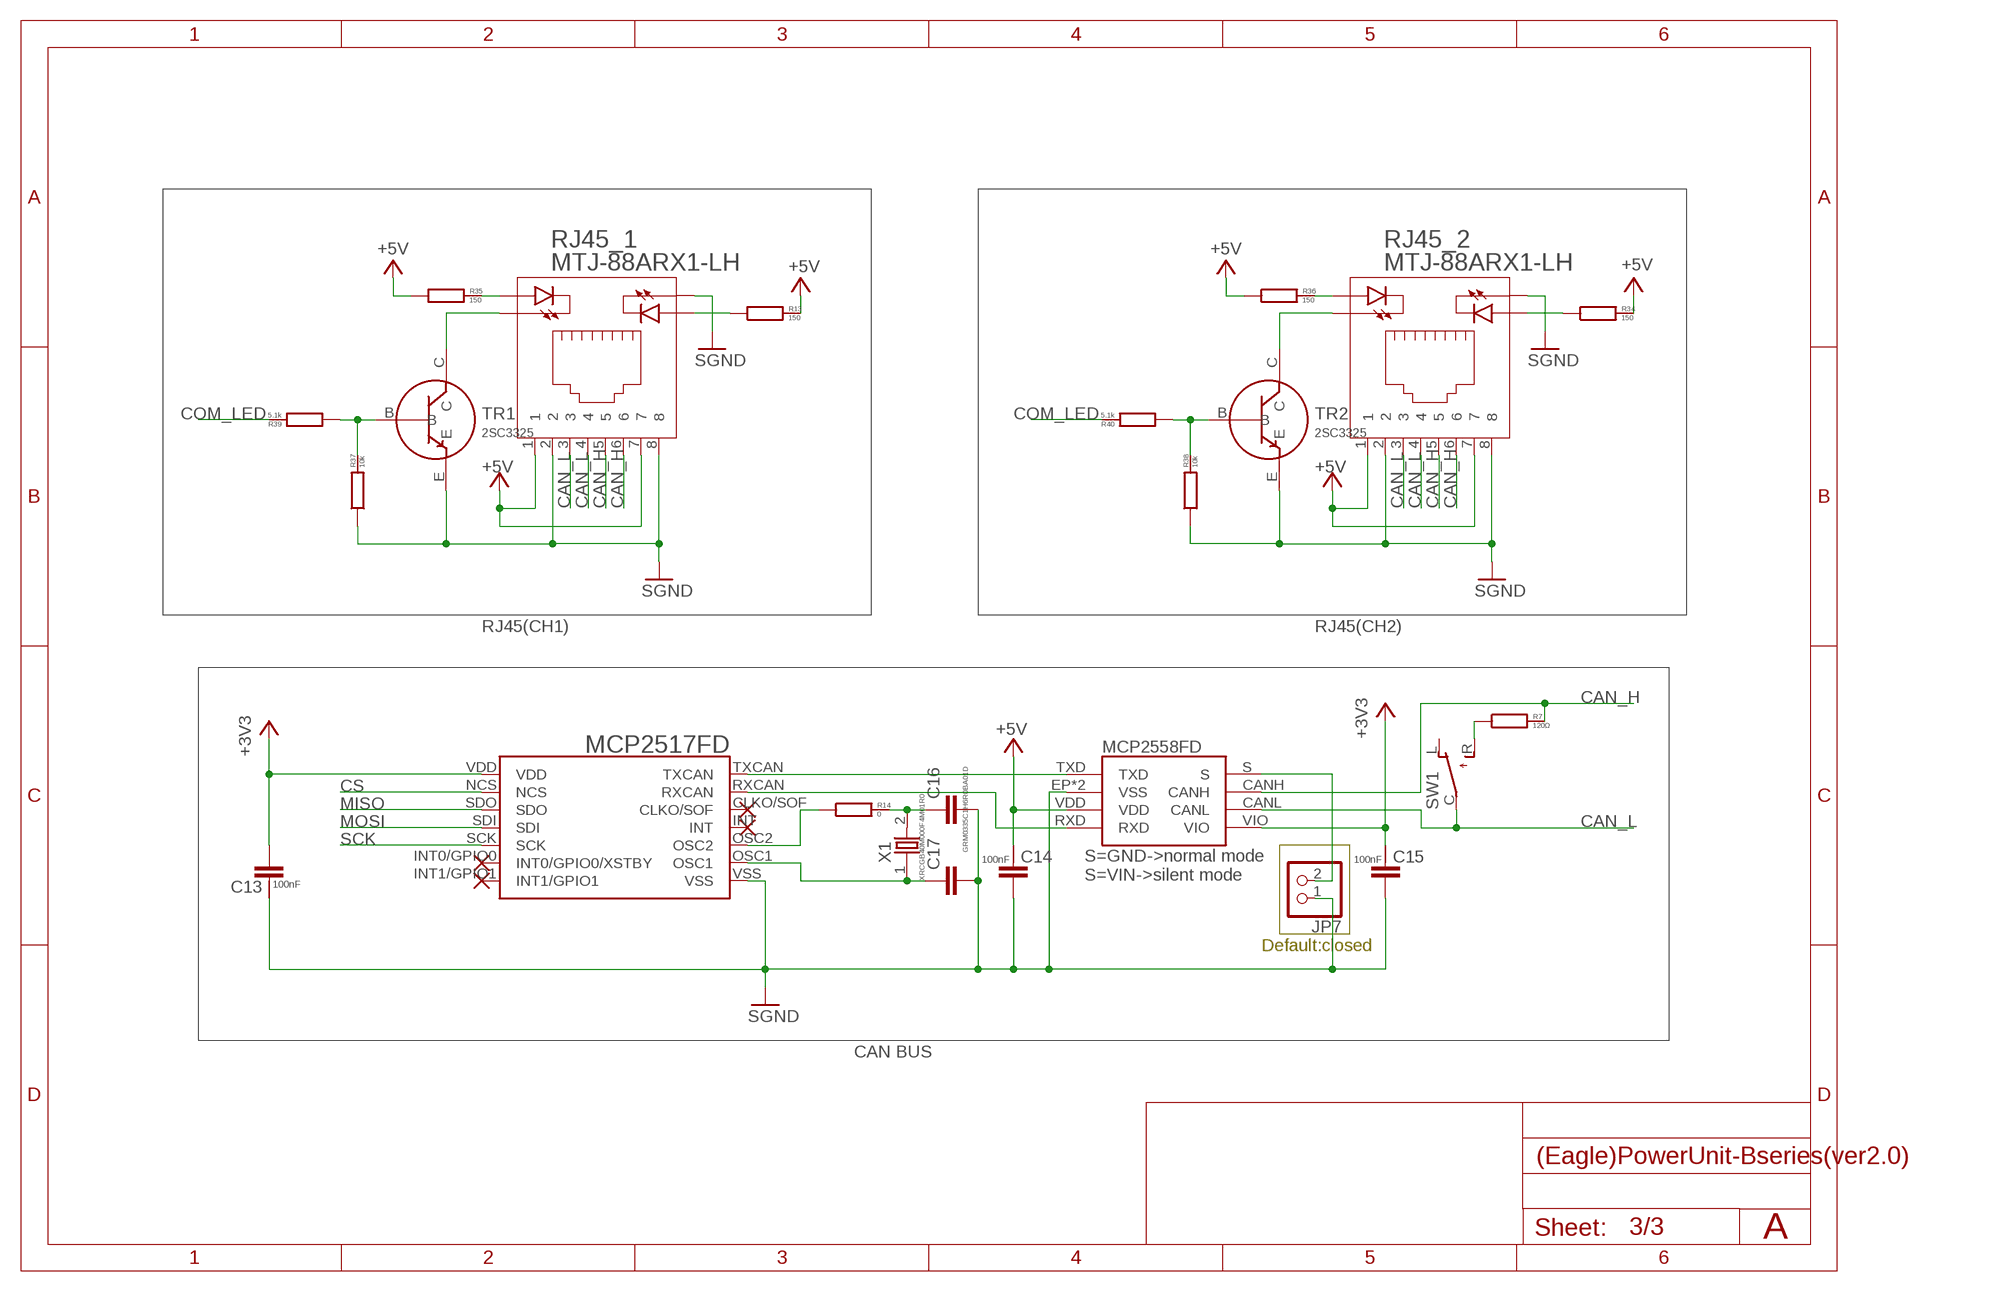
[diagram p3: schematic, sheet 3]

### Parts
C13  GCM188L81H104KA57  [GCM188L81H104KA57]
C14  GCM188L81H104KA57  [GCM188L81H104KA57]
C15  GCM188L81H104KA57  [GCM188L81H104KA57]
C16  GRM0335C1H6R0BA01D  [GRM0335C1H120GA01]
C17  GRM0335C1H6R0BA01D  [GRM0335C1H120GA01]
JP7  PINHD-1X2  [1X02]
R7  120Ω  CR0603  [CR0603]
R13  150  CR0603  [CR0603]
R14  0  CR0603  [CR0603]
R34  150  CR0603  [CR0603]
R35  150  CR0603  [CR0603]
R36  150  CR0603  [CR0603]
R37  10k  CR0603  [CR0603]
R38  10k  CR0603  [CR0603]
R39  5.1k  CR0603  [CR0603]
R40  5.1k  CR0603  [CR0603]
RJ45_1  MTJ-88ARX1-LH  [MTJ-88ARX1-LH]
RJ45_2  MTJ-88ARX1-LH  [MTJ-88ARX1-LH]
SW1  SS-12SDP2  [SS-12SDP2]
TR1  2SC3325  [2SC3325]
TR2  2SC3325  [2SC3325]
U2  MCP2517FD  [MCP2517FD]
U$1  MCP2558FD  [MCP2558FD]
X1  XRCGB40M000F4M01R0  [XRCGB40M000F4M00R0]

### Nets
+3V3: C13.P$2 C15.P$1 U2.VDD U$1.VIO ; also sheet 1,2
+5V: C14.P$1 R13.RIGHT R34.RIGHT R35.LEFT R36.LEFT RJ45_1.1 RJ45_1.7 RJ45_2.1 RJ45_2.7 U$1.VDD ; also sheet 1,2
CAN_H: R7.RIGHT RJ45_1.5 RJ45_1.6 RJ45_2.5 RJ45_2.6 U$1.CANH
CAN_L: RJ45_1.3 RJ45_1.4 RJ45_2.3 RJ45_2.4 SW1.C U$1.CANL
COM_LED: R39.RIGHT R40.RIGHT ; also sheet 2
CS: U2.NCS ; also sheet 2
MISO: U2.SDO ; also sheet 2
MOSI: U2.SDI ; also sheet 2
N$23: R7.LEFT SW1.R
N$27: U2.TXCAN U$1.TXD
N$28: U2.RXCAN U$1.RXD
N$38: R14.LEFT U2.OSC2
N$39: C17.1 U2.OSC1 X1.1
N$42: C16.1 R14.RIGHT X1.2
N$51: R13.LEFT RJ45_1.LED2_A
N$53: R34.LEFT RJ45_2.LED2_A
N$68: JP7.2 U$1.S
N$69: R35.RIGHT RJ45_1.LED1_A
N$70: R36.RIGHT RJ45_2.LED1_A
N$71: RJ45_1.LED1_K TR1.C
N$72: RJ45_2.LED1_K TR2.C
N$73: R38.RIGHT R40.LEFT TR2.B
N$74: R37.RIGHT R39.LEFT TR1.B
SCK: U2.SCK ; also sheet 2
SGND: C13.P$1 C14.P$2 C15.P$2 C16.2 C17.2 JP7.1 R37.LEFT R38.LEFT RJ45_1.2 RJ45_1.8 RJ45_1.LED2_K RJ45_2.2 RJ45_2.8 RJ45_2.LED2_K TR1.E TR2.E U2.VSS U$1.EP(VSS) U$1.VSS ; supply symbol labelled GND ; also sheet 1,2
Unconnected: SW1.L U2.CLKO/SOF U2.INT U2.INT0/GPIO0(INT0/GPIO0/XSTBY) U2.INT1/GPIO1

### Notes on the sheet
- RJ45(CH1) | RJ45(CH2)
- S=GND->normal mode
  S=VIN->silent mode
- Default:closed
- CAN BUS
- A

## Library data of the parts
B1 = CS11029.5F100:CS11029.5F100
B2 = PTS645SM95SMTR92LFS:PTS645SM95SMTR92LFS
BOOTMODE ECHO GND JP7 POW1 = pinhead:PINHD-1X2: PIN HEADER
C2 C23 C47 C50 C53 C56 C66 C67 C69 C71 = GRM21BC72A105KE01(1uF):GRM21BC72A105KE01
C3 C6 C8 C10 C11 C13-C15 C18-C22 C26 C31-C38 C43 C46 C57 C60 C61 C64 C65 C70 C72 C73 = GCM188L81H104K57(0.1uF):GCM188L81H104KA57
C4 C5 = GRM32ER71H106KA12:GRM32ER71H106KA12
C7 = A768EB566M1VLAE042:A768EB566M1VLAE042
C9 C12 = GRM32ER71E226KE15:GRM32ER71E226KE15
C16 C17 = GRM0335C1H6R0BA01D:GRM0335C1H6R0BA01D
C24 = GRM31CR71H475KA12:GRM31CR71H475KA12
C27 C28 = GRM0335C1E240GA01D:GRM0335C1E240GA01D
C29 C30 = GRM0335C1H150FA01D:GRM0335C1H150FA01D
C39-C42 C44 C45 C48 C49 C51 C52 C54 C55 C58 C59 C62 C63 = GRM1885C1H102JA01D:GRM1885C1H102JA01D
C68 = GRM0335C1H620GA01D:GRM0335C1H620GA01D
CON1-CON4 = amass:XT60: AMASS XT60 connector Store in Japan AMASS XT60 connector <https://szc.jp/ams-xt60>
CON5 IN = amass:XT90: AMASS XT90 connector Store in Japan AMASS XT90 connector <https://szc.jp/ams-xt90>
CTRL1 CTRL2 INV_SW1 INV_SW2 POW THRU1 THRU2 = con-jst-xh:02-JST: JST CONNECTOR
D1 D2 D4 = GS2M-LTP:GS2M-LTP
D3 = PJSD12TS:PJSD12TS
EDGE1-EDGE4 = 10046971-019LF-FEMAL:10046971-019LF-FEMAL
FB1 = BLM18KG121TN1D:BLM18KG121TN1D
FUSE1 = FUSEHOLDER-3568:FUSEHOLDER-3568
H1-H4 = MOUNT-HOLE3.2(NORESIST):MOUNT-HOLE3.2(NORESIST)
HEATSINK1 = V2020B:V2020B
JP1 JP6 JP8-JP10 = pinhead:PINHD-1X3: PIN HEADER
JP2-JP5 = con-jst-xh:05-JST: JST CONNECTOR
JP11 = pinhead:PINHD-1X6: PIN HEADER
L1 = NRS5030T4R7MMGJ:NRS5030T4R7MMGJ
LED1-LED15 = SML-E12V8WT86:SML-E12V8WT86
ML1 = 3220-14-0100-00:3220-14-0100-00
NTC1 = NCU15WB473F60RC:NCU15WB473F60RC
Q1 Q6 Q10 = SQJA16EP-T1_GE3:SQJA16EP-T1_GE3
Q2 = SSM3J332R:SSM3J332R
Q11 Q12 = TMBT3906:TMBT3906
R1 R2 R4-R90 R95-R108 R113 R115 R116 R119-R123 = CR0603:CR0603
R3 = RSMF2JT10R0:RSMF2JT10R0
RJ45_1 RJ45_2 = MTJ-88ARX1-LH:MTJ-88ARX1-LH
SB1-SB4 SB7 SB8 = RSX101VAM-30TR:RSX101VAM-30TR
SB5 = V2P22LHM3:V2P22LHM3/H
SB6 = 1SS404,H3F:1SS404,H3F
SW1 = SS-12SDP2:SS-12SDP2
SW2 = RDS-16S-1055-SMT-TR:RDS-16S-1055-SMT-TR
SW3 = SSSS213202:SSSS213202
SW4 SW5 = 2MS1-T2-B4-M2-Q-E-S:2MS1-T2-B4-M2-Q-E-S
TLP1 TLP3 = TLP152:TLP152
TP1-TP8 = GF063P B103K:GF063PB103K
TR1-TR3 = 2SC3325:2SC3325
U1 = STM32F446xC:LQFP64
U2 = MCP2517FD:MCP2517FD
U3 = CH340E:CH340E
U4 U6 U8 U9 = CZ3A04:CZ-3A04
U5 = AP63205WU-7:AP63205WU-7
U7 U11 U12 U24 U27 = MCP6541T-I:MCP6541T-I/LT
U10 U13 U17 U18 U21-U23 U25 = TC7S14F:TC7S14F
U14 = TCK420G:TCK420G
U15 = TCKE805NA:TCKE805NA
U16 U19 U26 = TC7SH00FULJ:TC7SH00FULJ
U20 = TLP293_Mylib:TLP293
U$1 = MCP2558FD:MCP2558FD
U$4 = AZ1117CH-3.3TRG1:AZ1117CH-3.3TRG1
USB1 = 5077CR-16SMC2-BK-TR:5077CR-16SMC2-BK-TR
X1 = XRCGB40M000F4M01R0:XRCGB40M000F4M01R0
X2 = RH100-24.000-18-1020-EXT-TR:RH100-24.000-18-1020-EXT-TR
X3 = 32.768K12.5PI:32.768K12.5PI/MC306
ZD1 = MMSZ5231B-TP:MMSZ5231B-TP
ZD5 = MMBZ5248B-TP:MMBZ5248B-TP